# EAGLE design driver-ha-v4-rev1 (EAGLE 6.5.0)
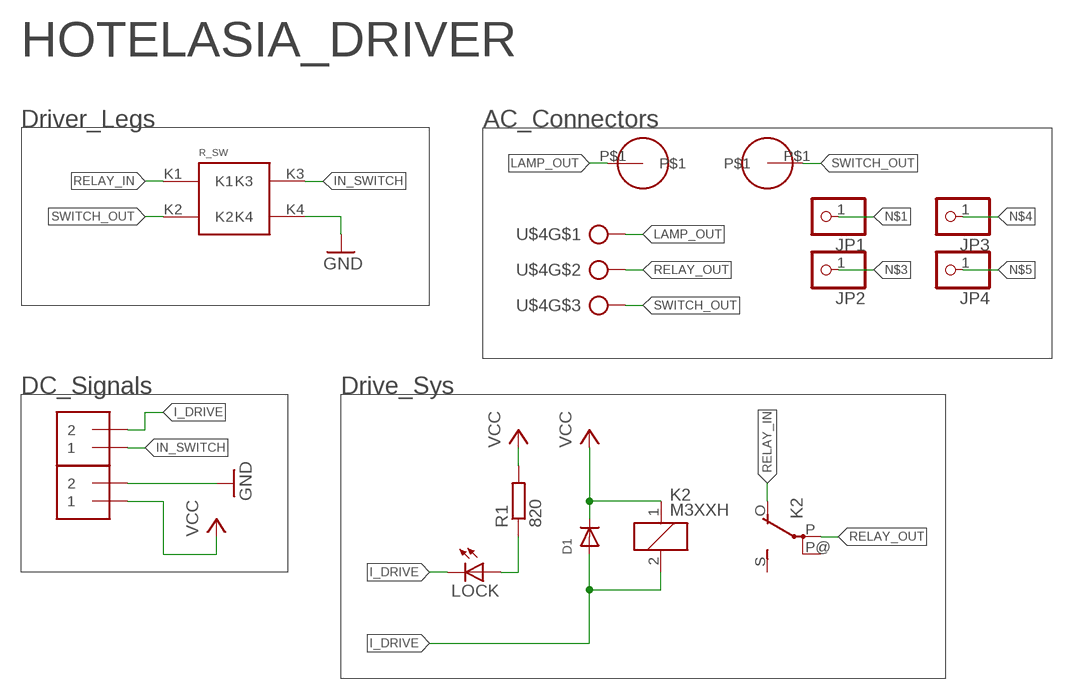
[diagram p0: schematic, sheet 1]

## Parts
D1  DIODESMA  [SMADIODE]
J1  1X2-3.5MM  [1X2-3.5MM]
J2  1X2-3.5MM  [1X2-3.5MM]
JP1  PINHD-1X1  [1X01]
JP2  PINHD-1X1  [1X01]
JP3  PINHD-1X1  [1X01]
JP4  PINHD-1X1  [1X01]
K2  M3XXH  [M3XXH]
LOCK  LED3MM  [LED3MM]
PAD1  ROOM_SWITCH  [ROOM_SWITCH]
R1  820  R-EU_R0805  [R0805]
U$1  CONN-CABLE  [CONN-CABLE]
U$3  CONN-CABLE  [CONN-CABLE]
U$4  AK3003  [AK3003]

## Nets
GND: J2.2 PAD1.K4
I_DRIVE: D1.A J1.2 K2.2 LOCK.K(C)
IN_SWITCH: J1.1 PAD1.K3
LAMP_OUT: U$1.P$1 U$4.1
N$1: JP1.1
N$2: LOCK.A R1.1
N$3: JP2.1
N$4: JP3.1
N$5: JP4.1
RELAY_IN: K2.O(2:O) PAD1.K1
RELAY_OUT: K2.P(2:P) U$4.2
SWITCH_OUT: PAD1.K2 U$3.P$1 U$4.3
VCC: D1.C J2.1 K2.1 R1.2
Unconnected: K2.P@(2:P) K2.S(2:S)

## Notes on the sheet
- HOTELASIA_DRIVER
- Driver_Legs | AC_Connectors
- DC_Signals | Drive_Sys

## Library data of the parts
D1 = adafruit:DIODE: Diode SMADIODE - SMA Surface Mount Package 20V 1A Schottky Diode Digikey: 641-1014-6-ND DO-1N4148 - Through Hole Small Current Diode SOD-123 20V 1 A (.5mV Vf) Schottky Diode - Digikey: MBRX120TPMSCT-ND SOD-323 10V 570mA (.38mV Vf, 3ns) Schottky Diode - Digikey: ZLLS410CT-ND SOD-523 30V 30mA Schottky Diode (RB751S-40TE61) - Digikey: RB751S-40TE61CT-ND SOT23-R/W - SOT23 Package (R = Solder Paste/Reflow Ovens, W = Hand-Soldering) BAT54Film 40V 300mA - Digikey: 497-7162-1-ND
J1 J2 = adafruit:1X2: 3.5mm Terminal block http://www.ladyada.net/library/pcb/eaglelibrary.html
JP1-JP4 = pinhead:PINHD-1X1: PIN HEADER
K2 = relay:M3XXH: RELAY 1 x switch; OC_FARNELL: unknown; OC_NEWARK: unknown
LOCK = adafruit:LED: LED OSRAM: - CHIPLED LG R971, LG N971, LY N971, LG Q971, LY Q971, LO R971, LY R971 LH N974, LH R974 LS Q976, LO Q976, LY Q976 LO Q996 - Hyper CHIPLED LW Q18S LB Q993, LB Q99A, LB R99A - SideLED LS A670, LO A670, LY A670, LG A670, LP A670 LB A673, LV A673, LT A673, LW A673 LH A674 LY A675 LS A676, LA A676, LO A676, LY A676, LW A676 LS A679, LY A679, LG A679 - Hyper Micro SIDELED® LS Y876, LA Y876, LO Y876, LY Y876 LT Y87S - SmartLED LW L88C, LW L88S LB L89C, LB L89S, LG L890 LS L89K, LO L89K, LY L89K LS L896, LA L896, LO L896, LY L896 - TOPLED LS T670, LO T670, LY T670, LG T670, LP T670 LSG T670, LSP T670, LSY T670, LOP T670, LYG T670 LG T671, LOG T671, LSG T671 LB T673, LV T673, LT T673, LW T673 LH T674 LS T676, LA T676, LO T676, LY T676, LB T676, LH T676, LSB T676, LW T676 LB T67C, LV T67C, LT T67C, LS T67K, LO T67K, LY T67K, LW E67C LS E67B, LA E67B, LO E67B, LY E67B, LB E67C, LV E67C, LT E67C LW T67C LS T679, LY T679, LG T679 LS T770, LO T770, LY T770, LG T770, LP T770 LB T773, LV T773, LT T773, LW T773 LH T774 LS E675, LA E675, LY E675, LS T675 LS T776, LA T776, LO T776, LY T776, LB T776 LHGB T686 LT T68C, LB T68C - Hyper Mini TOPLED® LB M676 - Mini TOPLED Santana® LG M470 LS M47K, LO M47K, LY M47K Source: http://www.osram.convergy.de/
PAD1 = maul:ROOM_SWITCH
R1 = resistor:R-EU_: RESISTOR, European symbol
U$1 U$3 = bontor:CONN-CABLE
U$4 = con-ptr500:AK3003

## Net classes
0 default: width 0.305 mm, drill 0.508 mm, clearance 5.08 mm

## Board
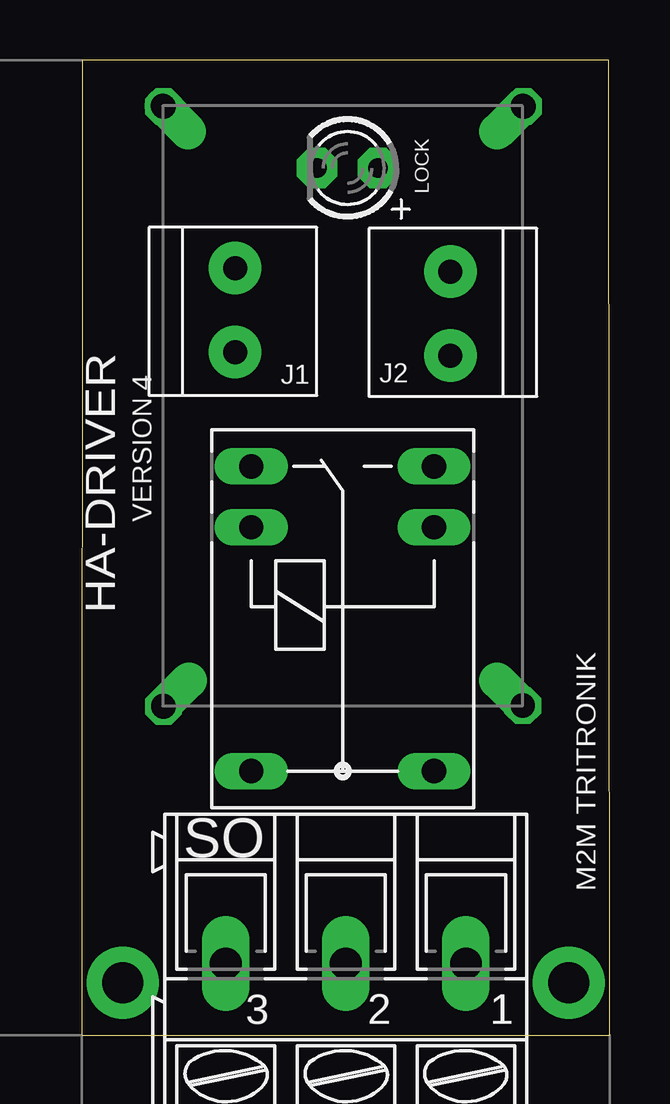
[diagram p1: board, top side]
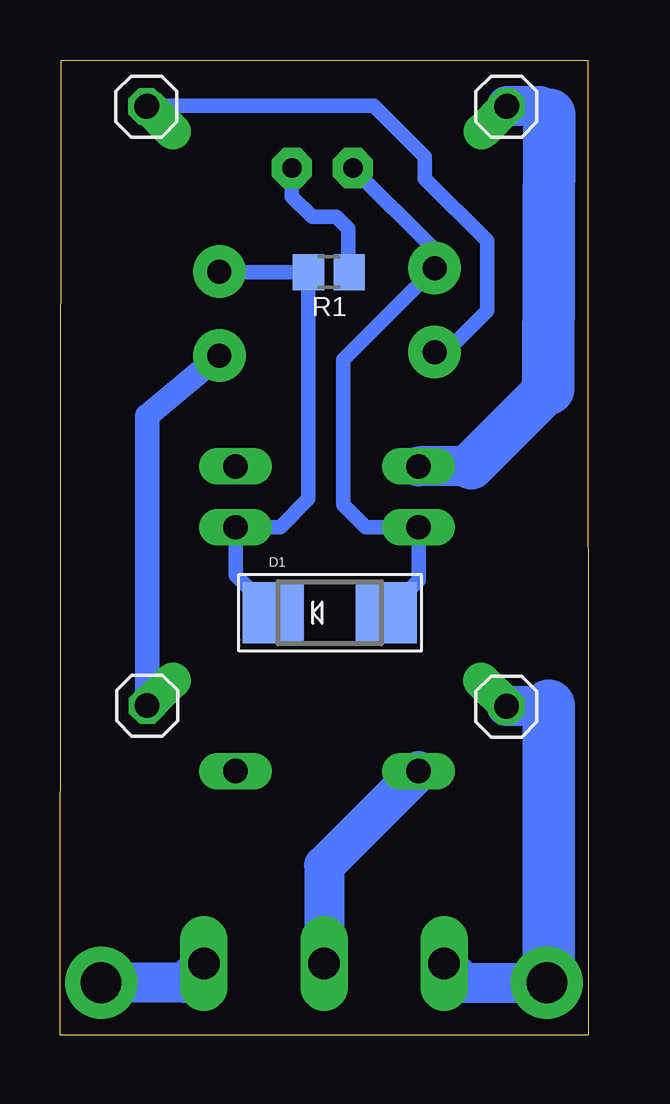
[diagram p2: board, bottom side, seen from below]

Size 22 x 40.64 mm. Coordinates in mm from the lower left corner, seen from the top.
Outline: 21.95,40.64 0.02,40.64 0,0 22,0 21.95,40.64
Copper layers (1*16): Top 0.035mm / dielectric 1.5mm / Bottom 0.035mm
Design rules "default": minimum track width 10mil, minimum drill 24mil, track to track 8mil, track to pad 8mil, pad to pad 8mil, via to via 8mil, smd to smd 8mil, copper to edge 40mil, drill to drill 8mil, minimum pad ring 10mil, minimum via ring 8mil, stop-mask expansion 4mil, vias tented up to drill 0mil, thermal gap 10mil

### Footprints (pad centres in the part's own frame; a part is rotated, then mirrored left to right if it is on the bottom)
SMADIODE = smd 2.54 x 2.54: A 2.349,0; C -2.349,0
1X2-3.5MM = drill 1 pad 2.184: 1 1.8,0; 2 -1.7,0
1X01 = drill 1.016 octagon: 1 0,0
M3XXH = drill 1.016 long: 1 -3.81,3.81; 2 -3.81,-3.81; O -6.35,-3.81; P 6.35,-3.81; P@ 6.35,3.81; S -6.35,3.81
LED3MM = drill 0.813 pad 1.676 octagon: A -1.27,0; K 1.27,0
ROOM_SWITCH = drill 1 offset: K1 -7.365,12.825; K2 -7.335,-12.175; K3 7.635,12.825; K4 7.635,-12.175
R0805 = smd 1.3 x 1.5: 1 -0.85,0; 2 0.85,0
CONN-CABLE = drill 1.7 pad 3: P$1 0,0
AK3003 = drill 1.321 long: 1 -5.004,0; 2 0,0; 3 5.004,0

### Placement (x,y rotation side)
D1  10.76,17.61 0 bottom
J1  6.39,30.27 270 top
J2  15.36,30.02 90 top
JP1  3.4,13.7 0 bottom
JP2  18.37,13.74 0 bottom
JP3  18.4,38.7 0 bottom
JP4  3.4,38.7 0 bottom
K2  10.87,17.36 270 top
LOCK  11.07,36.14 180 top
PAD1  10.73,25.9 0 top
R1  10.8,31.8 180 bottom
U$1  20.29,2.19 180 top
U$3  1.71,2.19 180 top
U$4  11,3 180 top

### Tracks (layer width: path | path; a pad name or v marks a point on that pad's centre or on a via)
GND
  Bottom 1.016: J2.2 18.36,25.82 PAD1.K4
I_DRIVE
  Bottom 0.61: D1.A 7.06,18.96 K2.2 9.27,21.17 10.2,22.1 10.2,28.16 J1.2 6.39,32.73 LOCK.K
IN_SWITCH
  Bottom 0.61: PAD1.K3 8.93,38.73 6.8,36.6 6.8,35.7 4.2,33.1 4.2,30.2 5.93,28.47 J1.1
LAMP_OUT
  Bottom 1.676: U$4.1 16.81,2.19 U$1.P$1
N$2
  Bottom 0.61: LOCK.A 12.34,34.94 11.5,34.1 10.5,34.1 10,33.6 10,31.85 R1.1
RELAY_IN
  Bottom 1.676: PAD1.K1 2,38.73 1.61,38.36 | 4.86,23.71 K2.O
  Bottom 1.93: 1.65,26.95 4.86,23.74 4.86,23.71
  Bottom 2.184: 1.61,38.36 1.65,26.95
RELAY_OUT
  Bottom 1.676: K2.P 11,7.07 U$4.2
SWITCH_OUT
  Bottom 1.676: PAD1.K2 1.65,13.72 1.63,13.74 | U$4.3 5.19,2.19 U$3.P$1
  Bottom 2.184: 1.63,13.74 1.63,2.27
  Bottom 2.54: 1.63,2.27 U$3.P$1
VCC
  Bottom 0.61: D1.C 14.68,19.18 K2.1 12.83,21.17 11.65,22.35 R1.2 15.34,31.8 J2.1

### Text on the board
tNames: VERSION 4 | HA-DRIVER | SO | M2M TRITRONIK
tValues: RO | LO